# EAGLE design ESP32-C6-WROOM Breakout (EAGLE 9.6.2)
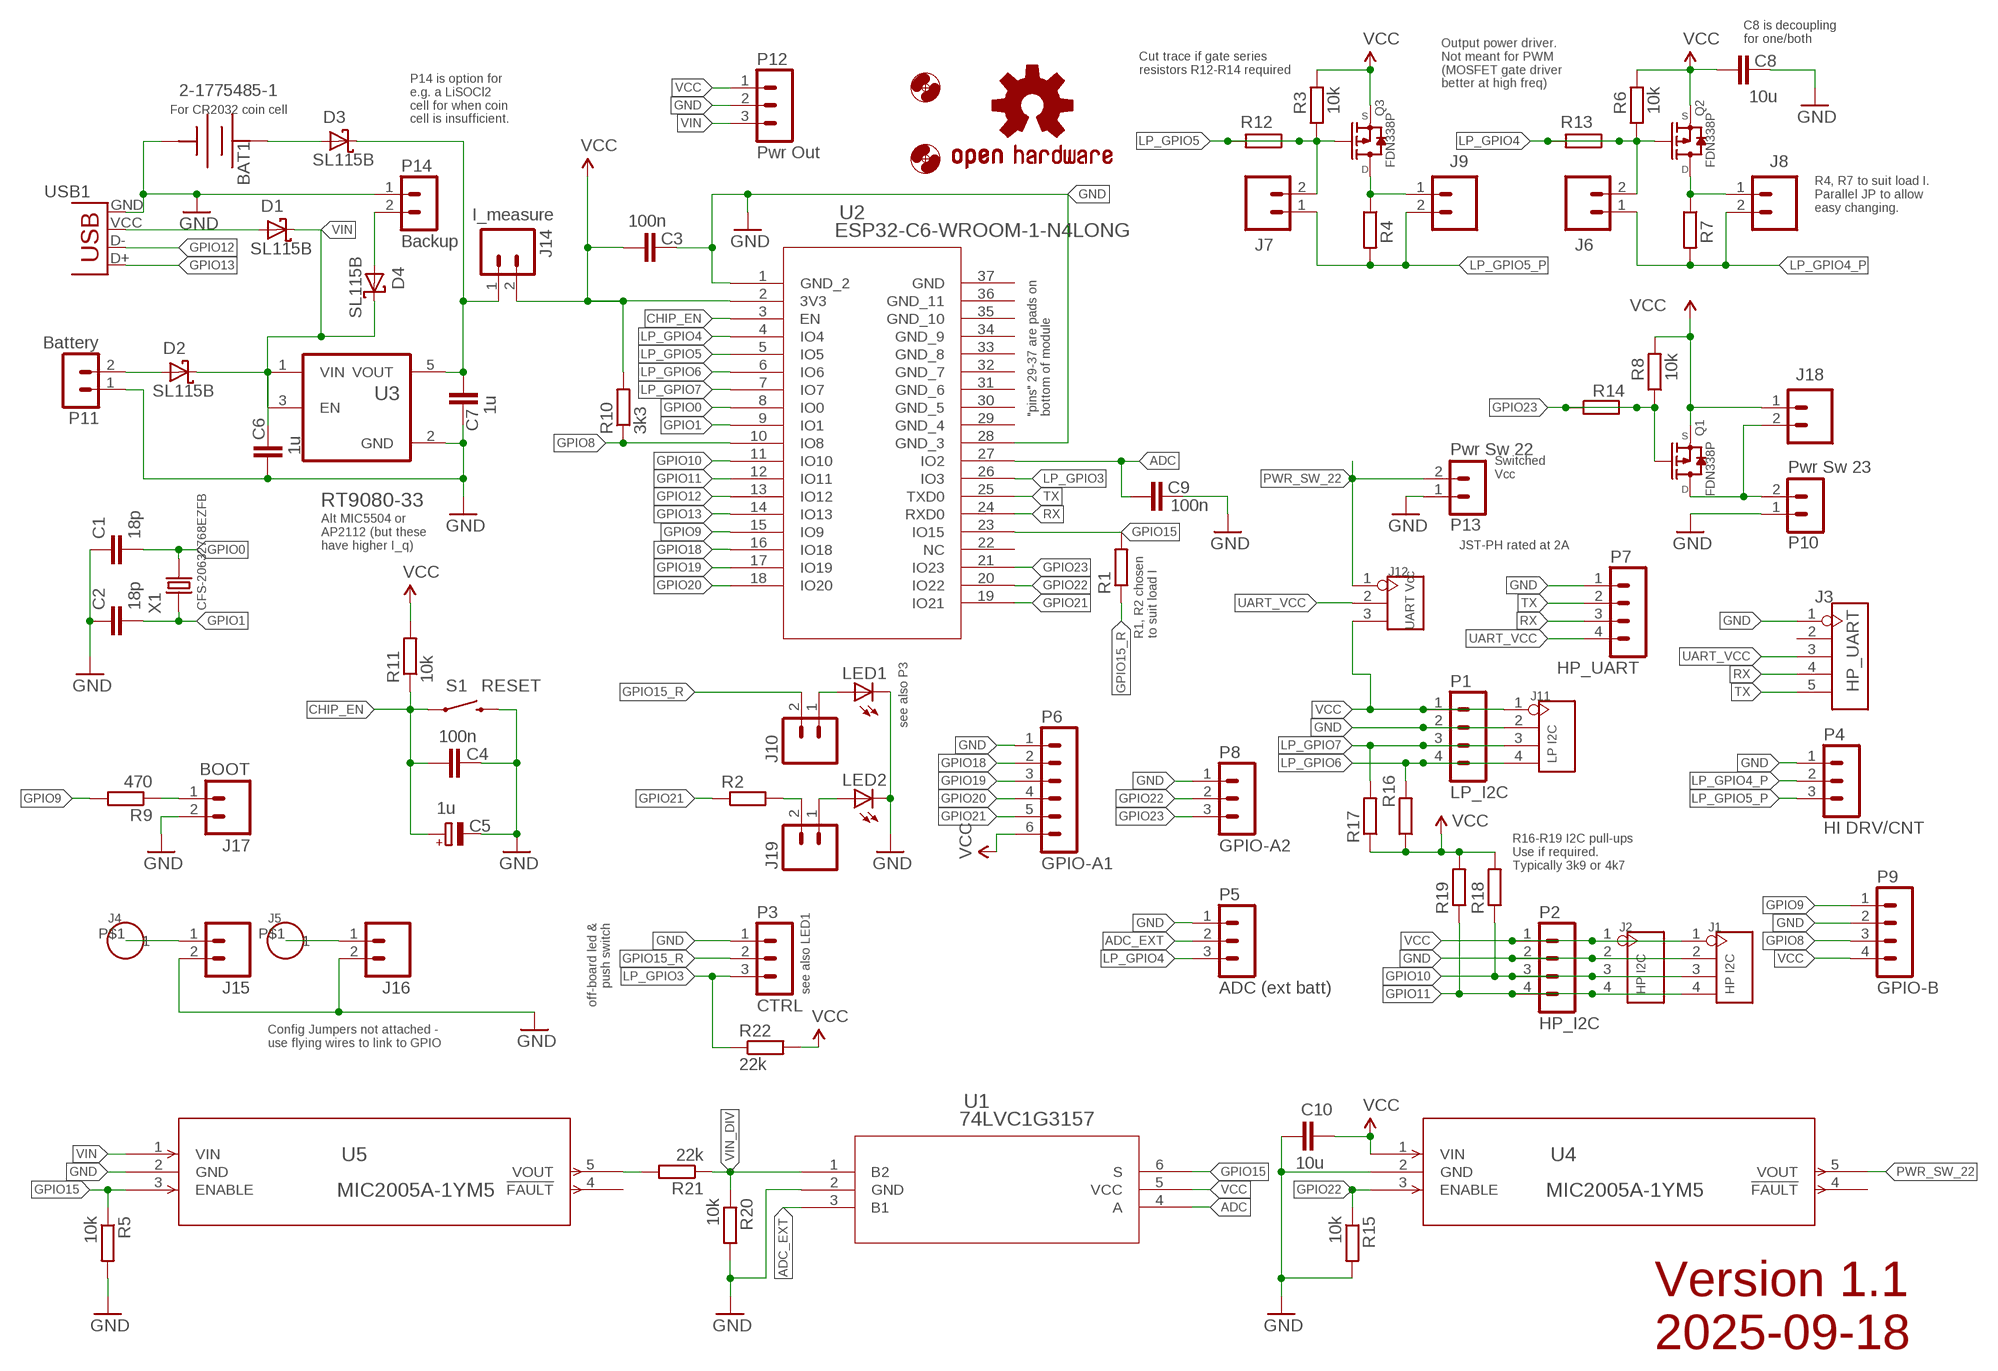
[diagram p0: schematic, sheet 1]

## Parts
BAT1  2-1775485-1  COIN-CELL  [COIN_2-1775485-1_TEC]
C1  18p  C-EU1206  [1206]
C2  18p  C-EU1206  [1206]
C3  100n  C-EU1206  [1206]
C4  100n  C-EU1206  [1206]
C5  1u  CPOL-EUE2.5-5**10UF  [E2,5-5]
C6  1u  C-EU1206  [1206]
C7  1u  C-EU1206  [1206]
C8  10u  C-EU1206  [1206]
C9  100n  C-EU1206  [1206]
C10  10u  C-EU1206  [1206]
D1  SL115B  DIODE-SCHOTTKY  [DO-214AA]
D2  SL115B  DIODE-SCHOTTKY  [DO-214AA]
D3  SL115B  DIODE-SCHOTTKY  [DO-214AA]
D4  SL115B  DIODE-SCHOTTKY  [DO-214AA]
H1  MOUNT-HOLE2.8  [2,8]
H2  MOUNT-HOLE2.8  [2,8]
J1  HP I2C  HEADER-4P-80/40MIL  [4P-2.54-80/40MIL]
J2  HP I2C  HEADER-4P-80/40MIL  [4P-2.54-80/40MIL]
J3  HP_UART  HEADER-5P-2.54  [5P-2.54]
J4  HEADER-1P-35  [1P-65/35MIL]
J5  HEADER-1P-35  [1P-65/35MIL]
J6  HEADER-1X2PPTH  [1X02]
J7  HEADER-1X2PPTH  [1X02]
J8  HEADER-1X2PPTH  [1X02]
J9  HEADER-1X2PPTH  [1X02]
J10  HEADER-1X2PPTH  [1X02]
J11  LP I2C  HEADER-4P-80/40MIL  [4P-2.54-80/40MIL]
J12  UART Vcc  HEADER-3P-2.54  [3P-2.54]
J14  I_measure  HEADER-1X2PPTH  [1X02]
J15  HEADER-1X2PPTH  [1X02]
J16  HEADER-1X2PPTH  [1X02]
J17  BOOT  HEADER-1X2PPTH  [1X02]
J18  HEADER-1X2PPTH  [1X02]
J19  HEADER-1X2PPTH  [1X02]
LED1  LED1206  [LED-1206]
LED2  LED1206  [LED-1206]
LOGO1  OSHW-LOGOL  [OSHW-LOGO-L]
P1  LP_I2C  B4B-EH-A  [B4B-EH-A]
P2  HP_I2C  B4B-EH-A  [B4B-EH-A]
P3  CTRL  B3B-EH-A  [B3B-EH-A]
P4  HI DRV/CNT  B3B-EH-A  [B3B-EH-A]
P5  ADC (ext batt)  B3B-EH-A  [B3B-EH-A]
P6  GPIO-A1  B6B-EH-A  [B6B-EH-A]
P7  HP_UART  B4B-EH-A  [B4B-EH-A]
P8  GPIO-A2  B3B-EH-A  [B3B-EH-A]
P9  GPIO-B  B4B-EH-A  [B4B-EH-A]
P10  Pwr Sw 23  B2B-PH-K  [B2B-PH-K]
P11  Battery  B2B-PH-K  [B2B-PH-K]
P12  Pwr Out  B3B-PH-K  [B3B-PH-K]
P13  Pwr Sw 22  B2B-PH-K  [B2B-PH-K]
P14  Backup  B2B-PH-K  [B2B-PH-K]
Q1  FDN338P  FDN338P_PMOSSOT23_LONG  [SOT23_LONG]
Q2  FDN338P  FDN338P_PMOSSOT23_LONG  [SOT23_LONG]
Q3  FDN338P  FDN338P_PMOSSOT23_LONG  [SOT23_LONG]
R1  R-EU_  [1206]
R2  R-EU_  [1206]
R3  10k  R-EU_  [1206]
R4  R-EU_  [1206]
R5  10k  R-EU_  [1206]
R6  10k  R-EU_  [1206]
R7  R-EU_  [1206]
R8  10k  R-EU_  [1206]
R9  470  R-EU_  [1206]
R10  3k3  R-EU_  [1206]
R11  10k  R-EU_  [1206]
R12  R-EU_  [1206]
R13  R-EU_  [1206]
R14  R-EU_  [1206]
R15  10k  R-EU_  [1206]
R16  4k7  R-EU_  [1206]
R17  4k7  R-EU_  [1206]
R18  4k7  R-EU_  [1206]
R19  4k7  R-EU_  [1206]
R20  10k  R-EU_  [1206]
R21  22k  R-EU_  [1206]
R22  22k  R-EU_  [1206]
S1  RESET  SWITCH-MOMENTARY-2PTH  [TACTILE-PTH]
U1  74LVC1G3157  SN74LVC1G3157DBVR  [DBV6]
U2  ESP32-C6-WROOM-1-N4LONG  [MOD28_ESP32-C6-WROOM-1_LONG]
U3  RT9080-33  AP2112K-3.3TRG1LONG_PADS  [SOT95-LONGPADS]
U4  MIC2005A-1YM5  MIC2005A-1YM5-TRSOT-23-5_M5_MCH-M  [SOT-23-5_M5_MCH-M]
U5  MIC2005A-1YM5  MIC2005A-1YM5-TRSOT-23-5_M5_MCH-M  [SOT-23-5_M5_MCH-M]
USB1  USB-FCI_SMD_LONG***  [FCI_USB_B_SMD_LONG]
X1  CFS-20632768EZFB  CRYSTAL-TC26H**  [TC26H]

## Nets
ADC: C9.1 U1.4(A) U2.27(IO2)
ADC_EXT: P5.2 U1.3(B1)
CHIP_EN: C4.2 C5.+ R11.1 S1.1 U2.3(EN)
GND: BAT1.2(NEG) C1.1 C2.1 C3.2 C4.1 C5.- C6.2 C7.2 C8.2 C9.2 C10.1 J1.2 J2.2 J3.1 J11.2 J15.2 J16.2 J17.2 LED1.C LED2.C P1.2 P2.2 P3.1 P4.1 P5.1 P6.1 P7.1 P8.1 P9.2 P10.1 P11.1 P12.2 P13.1 P14.1 R5.2 R15.2 R20.2 S1.3 U1.2(GND) U2.1(GND_2) U2.28(GND_3) U3.2(GND) U4.2(GND) U5.2(GND) USB1.GND
GPIO0: C1.2 U2.8(IO0) X1.2
GPIO1: C2.2 U2.9(IO1) X1.1
GPIO8: P9.3 R10.1 U2.10(IO8)
GPIO9: P9.1 R9.2 U2.15(IO9)
GPIO10: J1.3 J2.3 P2.3 R18.1 U2.11(IO10)
GPIO11: J1.4 J2.4 P2.4 R19.1 U2.12(IO11)
GPIO12: U2.13(IO12) USB1.D-
GPIO13: U2.14(IO13) USB1.D+
GPIO15: R1.2 R5.1 U1.6(S) U2.23(IO15) U5.3(ENABLE)
GPIO15_R: J10.2 P3.2 R1.1
GPIO18: P6.2 U2.16(IO18)
GPIO19: P6.3 U2.17(IO19)
GPIO20: P6.4 U2.18(IO20)
GPIO21: P6.5 R2.1 U2.19(IO21)
GPIO22: P8.2 R15.1 U2.20(IO22) U4.3(ENABLE)
GPIO23: P8.3 Q1.1(G) R8.1 R14.1 R14.2 U2.21(IO23)
LP_GPIO3: P3.3 R22.1 U2.26(IO3)
LP_GPIO4: J6.2 P5.3 Q2.1(G) R6.1 R13.1 R13.2 U2.4(IO4)
LP_GPIO4_P: J6.1 J8.2 P4.2 R7.2
LP_GPIO5: J7.2 Q3.1(G) R3.1 R12.1 R12.2 U2.5(IO5)
LP_GPIO5_P: J7.1 J9.2 P4.3 R4.2
LP_GPIO6: J11.4 P1.4 R16.2 U2.6(IO6)
LP_GPIO7: J11.3 P1.3 R17.2 U2.7(IO7)
N$1: J17.1 R9.1
N$2: D2.A P11.2
N$3: D1.A USB1.VCC(VBUS)
N$4: D4.A P14.2
N$5: J18.2 P10.2 Q1.3(D)
N$6: BAT1.1(POS) BAT1.3(POS) D3.A
N$7: J9.1 Q3.3(D) R4.1
N$8: J10.1 LED1.A
N$9: J5.P$1 J16.1
N$10: J19.2 R2.2
N$11: J19.1 LED2.A
N$12: J8.1 Q2.3(D) R7.1
N$13: C7.1 D3.C J14.1 U3.5(VOUT)
N$15: R21.2 U5.5(VOUT)
N$16: J4.P$1 J15.1
PWR_SW_22: J12.1 P13.2 U4.5(VOUT)
RX: J3.4 P7.3 U2.24(RXD0)
TX: J3.5 P7.2 U2.25(TXD0)
UART_VCC: J3.3 J12.2 P7.4
VCC: C3.1 C8.1 C10.2 J1.1 J2.1 J11.1 J12.3 J14.2 J18.1 P1.1 P2.1 P6.6 P9.4 P12.1 Q1.2(S) Q2.2(S) Q3.2(S) R3.2 R6.2 R8.2 R10.2 R11.2 R16.1 R17.1 R18.2 R19.2 R22.2 U1.5(VCC) U2.2(3V3) U4.1(VIN)
VIN: C6.1 D1.C D2.C D4.C P12.3 U3.1(VIN) U3.3(EN) U5.1(VIN)
VIN_DIV: R20.1 R21.1 U1.1(B2)
Unconnected: J3.2 U2.22(NC) U2.29(GND_4) U2.30(GND_5) U2.31(GND_6) U2.32(GND_7) U2.33(GND_8) U2.34(GND_9) U2.35(GND_10) U2.36(GND_11) U2.37(GND) U4.4(!FAULT) U5.4(!FAULT)

## Notes on the sheet
- C8 is decoupling
  for one/both
- Cut trace if gate series
  resistors R12-R14 required
- Output power driver.
  Not meant for PWM
  (MOSFET gate driver
  better at high freq)
- For CR2032 coin cell
- P14 is option for
  e.g. a LiSOCl2
  cell for when coin
  cell is insufficient.
- R4, R7 to suit load I.
  Parallel JP to allow
  easy changing.
- "pins" 29-37 are pads on
  bottom of module
- Switched
  Vcc
- Alt MIC5504 or
  AP2112 (but these
  have higher I_q)
- JST-PH rated at 2A
- R1, R2 chosen
  to suit load I
- see also P3
- R16-R19 I2C pull-ups
  Use if required.
  Typically 3k9 or 4k7
- off-board led &
  push switch
- see also LED1
- Config Jumpers not attached -
  use flying wires to link to GPIO
- Version 1.1
  2025-09-18

## Library data of the parts
BAT1 = Master 2016:COIN-CELL: Coin cell holders - various sizes of cell and footprints
C1-C4 C6-C10 = Master 2016:C-EU: CAPACITOR, European symbol
C5 = Master 2016:CPOL-EU: POLARIZED CAPACITOR, European symbol
D1-D4 = Master 2016:DIODE-SCHOTTKY: DIODE high speed (Philips)
H1 H2 = Master 2016:MOUNT-HOLE: MOUNTING HOLE with drill center marker
J1 J2 J11 = Connector:HEADER-4P
J3 = Connector:HEADER-5P
J4 J5 = Connector:HEADER-1P
J6-J10 J14-J19 = Master 2016:HEADER-1X2P: Header 2 Standard 2-pin 0.1" header. Use with straight break away headers (SKU : PRT-00116), right angle break away headers (PRT-00553), swiss pins (PRT-00743), machine pins (PRT-00117), and female headers (PRT-00115). Molex polarized connector foot print use with SKU : PRT-08233 with associated crimp pins and housings.
J12 = Connector:HEADER-3P
LED1 LED2 = Master 2016:LED: LEDs Standard schematic elements and footprints for 5mm, 3mm, 1206, and 0603 sized LEDs. 5mm - Spark Fun Electronics SKU : COM-00529 (and others)
LOGO1 = Master 2016:OSHW-LOGO: Open Source Hardware Logo This logo indicates the piece of hardware it is found on incorporates a OSHW license and/or adheres to the definition of open source hardware found here: http://freedomdefined.org/OSHW
P1 P2 P7 P9 = con-jst-eh:B4B-EH-A: HEADER
P3-P5 P8 = con-jst-eh:B3B-EH-A: HEADER
P6 = con-jst-eh:B6B-EH-A: HEADER
P10 P11 P13 P14 = con-jst-ph:B2B-PH-K: HEADER
P12 = con-jst-ph:B3B-PH-K: HEADER
Q1-Q3 = Master 2016:FDN338P_PMOS: Si2305DS Si2323CDS
R1-R22 = Master 2016:R-EU_: RESISTOR, European symbol
S1 = Master 2016:SWITCH-MOMENTARY-2: Various NO switches- pushbuttons, reed, etc
U1 = ESP32 Projects:SN74LVC1G3157DBVR; COPYRIGHT: Copyright (C) 2025 Ultra Librarian. All rights reserved.; MANUFACTURER_PART_NUMBER: SN74LVC1G3157DBVR; MFR_NAME: Texas Instruments
U2 = SMD Stamp Modules:ESP32-C6-WROOM-1-N4
U3 = AP2112K-3.3TRG1:AP2112K-3.3TRG1: AP2112 Series 0.6 A 3.3 V Fixed Output SMT LDO Linear Regulator - SOT23-5
U4 U5 = ESP32 Projects:MIC2005A-1YM5-TR; COPYRIGHT: Copyright (C) 2025 Ultra Librarian. All rights reserved.; MANUFACTURER_NAME: Microchip; MANUFACTURER_PART_NUMBER: MIC2005A-1YM5-TR
USB1 = Master 2016:USB: USB Connectors USB-B-PTH is fully proven SKU : PRT-00139 USB-miniB is fully proven SKU : PRT-00587 USB-A-PCB is untested. USB-A-H is throughly reviewed, but untested. Spark Fun Electronics SKU : PRT-00437 USB-B-SMT is throughly reviewed, but untested. Needs silkscreen touching up. USB-A-S has not been used/tested USB-MB-H has not been used/tested
X1 = Master 2016:CRYSTAL*: CRYSTAL

## Board
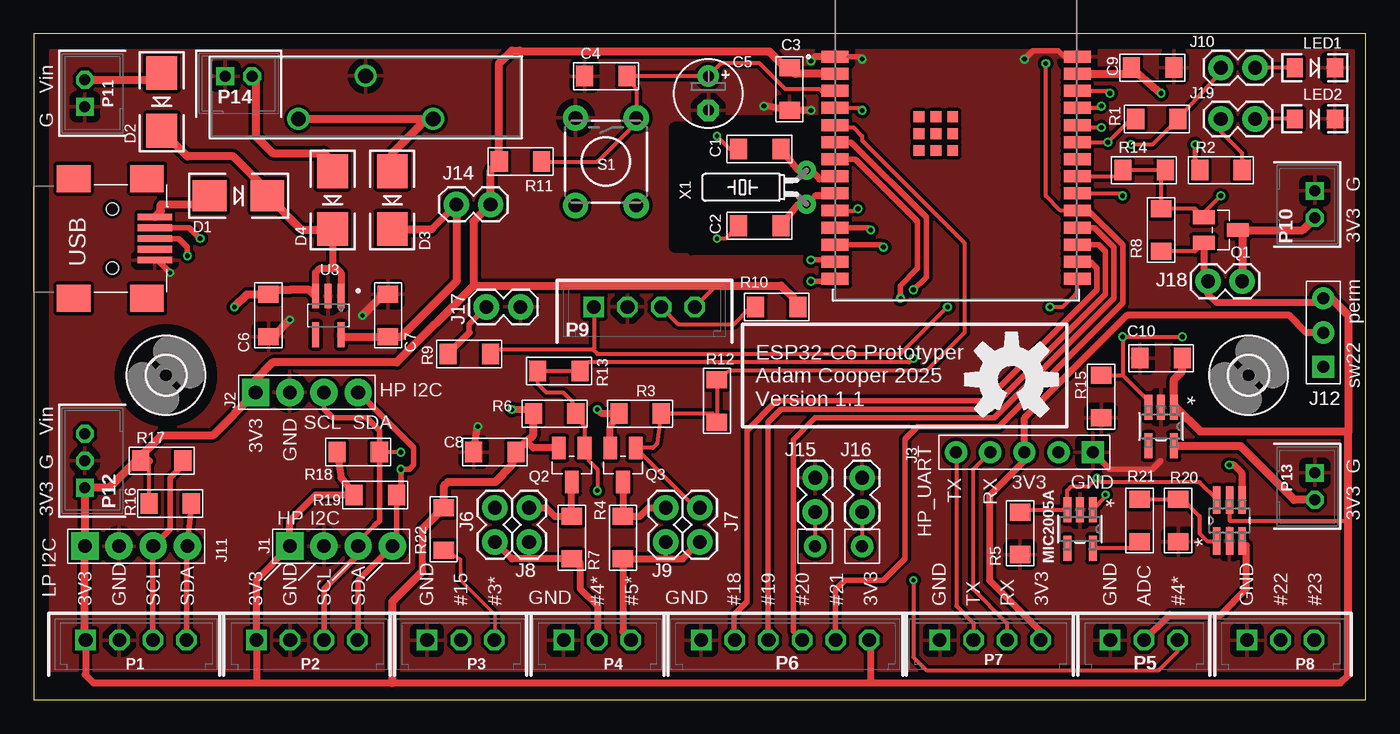
[diagram p1: board, top side]
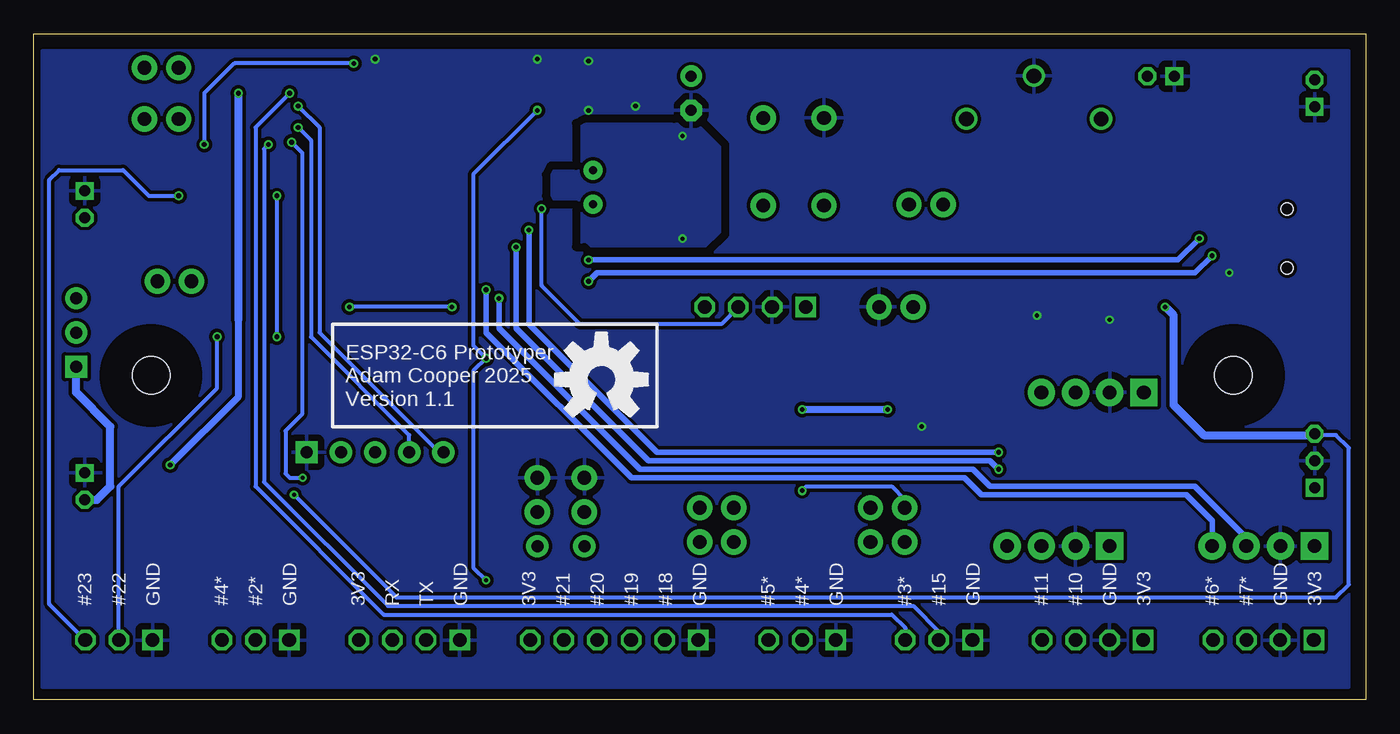
[diagram p2: board, bottom side, seen from below]

Size 99.05 x 49.52 mm. Coordinates in mm from the lower left corner, seen from the top.
Outline: 0,0 99.05,0 99.05,49.52 0,49.52 0,0
Copper layers (1*16): Top 0.035mm / dielectric 1.5mm / Bottom 0.035mm
Design rules "Seeed Fusion_eagle_rule_v1.1 *": minimum track width 6mil, minimum drill 12mil, track to track 6mil, track to pad 6mil, pad to pad 6mil, via to via 6mil, smd to smd 0mil, copper to edge 10mil, drill to drill 10mil, minimum pad ring 10mil, minimum via ring 6mil, stop-mask expansion 2mil, vias tented up to drill 100mil, thermal gap 20mil
tRestrict: area 47.6,33.7 to 58.4,42.5; 8 lines
bRestrict: 15 lines

### Footprints (pad centres in the part's own frame; a part is rotated, then mirrored left to right if it is on the bottom)
COIN_2-1775485-1_TEC = drill 1.092 pad 1.6: 1 0,0; 2 5.004,3.2; 3 10.008,0
1206 = smd 1.27 x 1.524: 1 -1.575,0; 2 1.575,0
E2,5-5 = drill 0.813 pad 1.6: + -1.27,0 | drill 0.813 pad 1.6 octagon: - 1.27,0
DO-214AA = smd 2.5 x 2.3: A -2.15,0; C 2.15,0
2,8 = hole 2.8: 0,0
4P-2.54-80/40MIL = drill 1.016 pad 2.032 square: 1 0,3.81 | drill 1.016 pad 2.032: 2 0,1.27; 3 0,-1.27; 4 0,-3.81
5P-2.54 = drill 0.889 pad 1.651 square: 1 0,5.08 | drill 0.889 pad 1.651: 2 0,2.54; 3 0,0; 4 0,-2.54; 5 0,-5.08
1P-65/35MIL = drill 0.889 pad 1.651: P$1 0,0
1X02 = drill 1.016 pad 1.88: 1 0,0; 2 2.54,0
3P-2.54 = drill 0.889 pad 1.651 square: 1 0,2.54 | drill 0.889 pad 1.651: 2 0,0; 3 0,-2.54
LED-1206 = smd 1.2 x 1.4: A -1.5,0; C 1.5,0
B4B-EH-A = drill 1.016 square: 1 -3.75,0 | drill 1.016 octagon: 2 -1.25,0; 3 1.25,0; 4 3.75,0
B3B-EH-A = drill 1.016 square: 1 -2.5,0 | drill 1.016 octagon: 2 0,0; 3 2.5,0
B6B-EH-A = drill 1.016 square: 1 -6.25,0 | drill 1.016 octagon: 2 -3.75,0; 3 -1.25,0; 4 1.25,0; 5 3.75,0; 6 6.25,0
B2B-PH-K = drill 0.813 square: 1 -1,0 | drill 0.813 octagon: 2 1,0
B3B-PH-K = drill 0.813 square: 1 -2,0 | drill 0.813 octagon: 2 0,0; 3 2,0
SOT23_LONG = smd 1.016 x 1.651: 1 -0.95,-1.27; 2 0.95,-1.27; 3 0,1.27
TACTILE-PTH = drill 1.016 pad 1.88: 1 -3.251,2.261; 2 3.251,2.261; 3 -3.251,-2.261; 4 3.251,-2.261
DBV6 = smd 2.032 x 0.559: 1 -1.524,0.95; 2 -1.524,0; 3 -1.524,-0.95; 4 1.524,-0.95; 5 1.524,0; 6 1.524,0.95
MOD28_ESP32-C6-WROOM-1_LONG = smd 2.007 x 0.889: 1 -9.004,5.26; 2 -9.004,3.99; 3 -9.004,2.72; 4 -9.004,1.45; 5 -9.004,0.18; 6 -9.004,-1.09; 7 -9.004,-2.36; 8 -9.004,-3.63; 9 -9.004,-4.9; 10 -9.004,-6.17; 11 -9.004,-7.44; 12 -9.004,-8.71; 13 -9.004,-9.98; 14 -9.004,-11.25; 15 9.004,-11.25; 16 9.004,-9.98; 17 9.004,-8.71; 18 9.004,-7.44; 19 9.004,-6.17; 20 9.004,-4.9; 21 9.004,-3.63; 22 9.004,-2.36; 23 9.004,-1.09; 24 9.004,0.18; 25 9.004,1.45; 26 9.004,2.72; 27 9.004,3.99; 28 9.004,5.26 | smd 0.813 x 0.813: 29 -1.505,-0.46; 30 -2.755,0.79; 31 -2.755,-0.46; 32 -2.755,-1.71; 33 -1.505,-1.71; 34 -0.255,-1.71; 35 -0.255,-0.46; 36 -0.255,0.79; 37 -1.505,0.79
SOT95-LONGPADS = smd 1.858 x 0.6: 1 -1.439,0.95; 2 -1.439,0; 3 -1.439,-0.95; 4 1.439,-0.95; 5 1.439,0.95
SOT-23-5_M5_MCH-M = smd 1.857 x 0.597: 1 -1.439,0.95; 2 -1.439,0; 3 -1.439,-0.95; 4 1.439,-0.95; 5 1.439,0.95
FCI_USB_B_SMD_LONG = smd 0.5 x 2.54: D+ 0,9.017; D- -0.8,9.017; GND 1.6,9.017; ID 0.8,9.017; VCC -1.6,9.017 | smd 2 x 2.5: SH$1 -4.45,8.43; SH$2 4.45,8.43; SH$3 4.45,2.98; SH$4 -4.45,2.98 | hole 0.9: -2.2,5.85; 2.2,5.85
TC26H = drill 0.6 pad 1.422: 1 -1.27,0; 2 1.27,0

### Placement (x,y rotation side)
BAT1  19.68,43.18 0 top
C1  53.98,40.96 0 top
C2  53.98,35.24 0 top
C3  56.2,45.4 270 top
C4  42.55,46.35 0 top
C5  50.16,45.09 270 top
C6  17.46,28.57 270 top
C7  26.35,28.57 90 top
C8  34.29,18.41 180 top
C9  83.19,46.99 0 top
C10  83.82,25.4 0 top
D1  15.24,37.47 0 top
D2  9.53,44.45 270 top
D3  26.67,37.15 270 top
D4  22.23,37.15 270 top
H1  9.84,24.13 0 top
H2  90.32,24.13 0 top
J1  22.86,11.43 90 top
J2  20.32,22.86 90 top
J3  73.66,18.41 270 top
J4  58.1,11.43 0 top
J5  61.59,11.43 0 top
J6  34.29,11.75 90 top
J7  49.53,11.75 90 top
J8  36.83,14.29 270 top
J9  46.99,14.29 270 top
J10  90.81,46.99 180 top
J11  7.62,11.43 90 top
J12  95.89,27.3 180 top
J14  31.43,36.83 0 top
J15  58.1,13.97 90 top
J16  61.59,13.97 90 top
J17  33.66,29.21 0 top
J18  87.31,31.11 0 top
J19  90.81,43.18 180 top
LED1  95.25,46.99 0 top
LED2  95.25,43.18 0 top
LOGO1  72.71,23.81 0 top
LOGO2  OSHW-LOGOL  [OSHW-LOGO-L]  56.83,23.81 0 bottom
P1  7.62,4.45 0 top
P2  20.32,4.45 0 top
P3  31.75,4.45 0 top
P4  41.91,4.45 0 top
P5  82.55,4.45 0 top
P6  55.88,4.45 0 top
P7  71.12,4.45 0 top
P8  92.71,4.45 0 top
P9  45.4,29.21 0 top
P10  95.25,36.83 270 top
P11  3.81,45.09 90 top
P12  3.81,17.78 90 top
P13  95.25,15.88 270 top
P14  15.24,46.35 0 top
Q1  88.27,34.92 270 top
Q2  40.01,17.46 180 top
Q3  43.81,17.46 180 top
R1  83.5,43.18 180 top
R2  88.27,39.37 0 top
R3  45.09,21.27 180 top
R4  43.81,12.06 270 top
R5  73.34,12.38 270 top
R6  38.73,21.27 180 top
R7  40.01,12.06 270 top
R8  83.82,34.92 270 top
R9  32.38,25.72 0 top
R10  55.24,29.21 0 top
R11  36.2,40.01 180 top
R12  50.8,22.23 90 top
R13  39.05,24.45 0 top
R14  82.55,39.37 0 top
R15  79.38,22.54 270 top
R16  10.16,14.61 0 top
R17  9.53,17.78 0 top
R18  24.13,18.41 180 top
R19  25.4,15.24 180 top
R20  85.09,13.34 270 top
R21  82.23,13.34 270 top
R22  30.48,12.7 90 top
S1  42.55,40.01 270 top
U1  88.9,13.34 90 top
U2  68.58,42.55 0 top
U3  21.91,28.57 270 top
U4  83.82,20.32 270 top
U5  77.79,12.7 270 top
USB1  0,34.29 270 top
X1  57.47,38.1 90 top

### Tracks (layer width: path | path; a pad name or v marks a point on that pad's centre or on a via)
ADC  (via drill 0.35)
  Top 0.152: 81.46,46.53 C9.1
  Top 0.508: U1.4 89.85,16.83 89.22,17.46 v88.9,17.46
  Top 0.61: U2.27 81.46,46.53 | C9.1 v83.82,45.09
  Bottom 0.508: v88.9,17.46 83.82,22.54 83.82,28.26
  Bottom 0.61: 83.82,28.26 v83.82,45.09
ADC_EXT
  Top 0.305: 90.17,11.49 U1.3
  Top 0.508: P5.2 84.45,6.35 88.27,6.35 90.17,8.26 90.17,11.49
CHIP_EN
  Top 0.305: U2.3 58.56,45.27 58.42,45.4 55.88,45.4 53.98,47.31 51.12,47.31 C5.+ C4.2 44.81,45.36 S1.1 44.81,42.9 41.91,40.01 R11.1
GND  (via drill 0.3 pad 0.61, 0.35)
  Top 0.305: U2.28 76.66,47.8 | 58.1,47.8 v57.78,47.49 | C1.1 51.75,40.96 v50.8,41.91 | C2.1 51.45,34.29 v50.8,34.29
  Top 0.406: U2.1 61.41,47.8 v61.59,47.62 | 76.66,47.8 76.2,48.26 74.3,48.26 v73.66,47.62 | 83.82,17.78 83.19,17.14 80.01,17.14 J3.1 | USB1.GND 9.22,32.69 v10.16,31.75
  Top 0.508: v54.29,44.13 54.39,44.17 C3.2 57.19,43.83 57.2,43.76 57.25,43.81 v57.78,43.81 | U2.1 58.1,47.8 | C8.2 v33.02,20.32
  Top 0.61: 82.55,25.4 C10.1 | C6.2 17.79,27 v19.05,28.26 | C7.2 26.02,30.15 v24.45,28.57
  pour Bottom (isolate 0.254): 1.27,48.26 1.27,0.95 98.42,0.95 98.42,48.26
  pour Top (isolate 0.254): 1.27,48.26 1.27,2.22 98.11,2.22 98.11,48.26
GPIO0
  Top 0.305: 56.83,39.37 X1.2 57.78,39.05 58.1,39.05 | 58.42,38.73 59.65,38.73 U2.8
  Top 0.508: 56.83,39.37 C1.2 | 58.1,39.05 58.42,38.73
GPIO1
  Top 0.305: U2.9 59.65,37.47 | 58.1,37.47 X1.1 56.83,36.83
  Top 0.508: 59.65,37.47 58.1,37.47 | 56.83,36.83 C2.2
GPIO8  (via drill 0.35)
  Top 0.305: U2.10 61.14,36.38 v61.28,36.51 | P9.3 47.92,27.94 52.07,27.94 53.34,29.21 R10.1
  Bottom 0.305: v61.28,36.51 61.28,30.8 58.42,27.94 47.92,27.94 P9.3
GPIO9  (via drill 0.35)
  Top 0.305: v75.56,29.21 76.52,29.21 77.44,30.13 77.58,30.5 U2.15 | v67.94,29.21 64.45,25.72 41.91,25.72 41.59,26.04 | 41.59,26.04 34.28,26.04 R9.2 | P9.1 41.65,26.09 41.59,26.04
  Bottom 0.305: v67.94,29.21 v75.56,29.21
GPIO10  (via drill 0.35)
  Top 0.305: P2.3 21.59,4.46 | 24.13,10.79 J1.3 24.13,11.75 25.35,12.97 25.35,12.98 | 62.05,35.1 v62.23,34.92 | v27.3,18.41 R18.1 | J2.3 21.59,21.59 | 25.72,20 25.7,20
  Top 0.406: 21.59,4.46 21.59,8.26 24.13,10.79 | U2.11 62.05,35.1 | 25.35,12.98 25.7,13.34 R18.1 25.7,20 | 21.59,21.59 22.23,20.95 24.77,20.95 25.72,20
  Bottom 0.406: v62.23,34.92 62.23,27.94 52.7,18.41 v27.3,18.41
GPIO11  (via drill 0.35)
  Top 0.305: P2.4 24.13,4.5 | 63,33.84 v63.18,33.66 | 27.3,15.88 R19.1 | 26.98,11.73 J1.4
  Top 0.406: 24.13,4.5 24.13,8.89 J1.4 | U2.12 63,33.84 | 27.3,15.88 v27.3,17.14 27.94,17.14 28.26,17.46 28.26,18.73 J2.4 | R19.1 26.98,11.73
  Bottom 0.406: v63.18,33.66 63.18,27.62 53.34,17.78 27.94,17.78 v27.3,17.14
GPIO12  (via drill 0.35)
  Top 0.305: U2.13 59.69,32.7
  Top 0.406: 59.69,32.7 v57.78,32.7 | USB1.D- 11.58,35.09 v12.38,34.29
  Bottom 0.406: v12.38,34.29 13.97,32.7 v57.78,32.7
GPIO13  (via drill 0.35)
  Top 0.305: 59.65,31.11 U2.14
  Top 0.406: v57.78,31.11 59.65,31.11 | USB1.D+ 10.79,34.29 11.43,33.66 v11.43,33.02
  Bottom 0.406: v57.78,31.11 57.15,31.75 12.7,31.75 v11.43,33.02
GPIO15  (via drill 0.3 pad 0.61, 0.35)
  Top 0.305: U2.23 v79.87,41.45 81.75,43.33 R1.2 | U1.6 87.95,14.92 86.68,16.19 79.38,16.19 v79.06,16.51 78.42,15.88 77.15,15.88 76.84,15.56 U5.3 73.52,14.14 R5.1
  Bottom 0.305: v79.87,41.45 79.06,40.64 79.06,21.27 80.33,20 80.33,16.83 80.01,16.51 v79.06,16.51
GPIO15_R  (via drill 0.35)
  Top 0.305: J10.2 88.27,46.65 R1.1 83.19,41.27 v81.6,41.27
  Bottom 0.305: v81.6,41.27 81.92,40.96 81.92,16.19 72.71,6.99 33.66,6.99 31.75,5.08 P3.2
GPIO18
  Top 0.305: U2.16 78.56,32.56
  Top 0.381: 52.07,4.5 P6.2
  Top 0.406: 78.56,32.56 79.06,32.07 79.06,30.48 70.8,22.23 55.24,22.23 53.02,20 53.02,7.3 52.07,6.35 52.07,4.5
GPIO19
  Top 0.305: P6.3 54.61,4.46
  Top 0.406: U2.17 79.19,33.84 79.69,33.34 79.69,30.16 71.12,21.59 55.56,21.59 54.61,20.64 54.61,4.46
GPIO20
  Top 0.305: P6.4 56.48,5.1
  Top 0.406: U2.18 78.88,35.1 80.33,33.66 80.33,29.84 71.44,20.95 58.1,20.95 56.48,19.33 56.48,5.1
GPIO21  (via drill 0.35)
  Top 0.305: 78.42,36.38 U2.19 76.34,36.38 75.25,37.47 v75.25,47.31 | 59.61,4.46 P6.5
  Top 0.381: R2.1 86.36,39.54 v86.36,41.27
  Top 0.406: 78.42,36.38 80.96,33.84 80.96,29.53 71.75,20.32 65.72,20.32 64.77,19.37 64.77,10.48 63.18,8.89 60.33,8.89 59.61,8.18 59.61,4.46
  Bottom 0.305: v86.36,41.27 86.36,45.09 84.14,47.31 v75.25,47.31
GPIO22  (via drill 0.35)
  Top 0.305: U2.20 80.78,37.65 v80.96,37.47 | v85.41,26.99 v80.96,26.99 80.96,24.13 | U4.3 82.87,22.22 80.96,24.13 | R15.1 80.96,24.13
  Bottom 0.305: v80.96,37.47 v80.96,26.99 | P8.2 92.71,15.88 85.41,23.18 v85.41,26.99
GPIO23  (via drill 0.35)
  Top 0.305: U2.21 80.83,38.91 R14.1 R14.2 83.82,39.06 R8.1 83.84,36.5 83.84,36.51 86.36,36.51 Q1.1 87,36.2 v88.27,37.47
  Bottom 0.305: P8.3 97.88,7.11 97.88,38.65 97.16,39.37 92.39,39.37 90.49,37.47 v88.27,37.47
LP_GPIO3  (via drill 0.35)
  Top 0.254: R22.1 31.75,10.46 31.75,8.89 34.29,6.35 34.29,4.49 P3.3
  Top 0.305: U2.26 79.83,45.27 v80.01,45.09
  Bottom 0.305: v80.01,45.09 82.55,42.55 82.55,15.88 73.03,6.35 35.24,6.35 34.25,5.36 P3.3
LP_GPIO4  (via drill 0.3 pad 0.61, 0.35)
  Top 0.254: 37.48,23.48 R13.1
  Top 0.305: R13.1 R13.2 41.26,25.08 65.09,25.08 v65.41,25.4 | U2.4 61.41,43.99 v61.59,43.81 | v41.91,15.56 41.91,17.14 41.27,17.78 41.27,18.41 Q2.1 40.95,20.32 R6.1 40.01,22.23 39.37,22.86 38.1,22.86 37.48,23.48 | v65.41,8.89 65.41,3.17 66.36,2.22 83.64,2.22 85.05,3.63 P5.3
  Bottom 0.305: v61.59,43.81 66.36,39.05 66.36,26.35 v65.41,25.4 66.36,24.45 66.36,9.84 v65.41,8.89 | J6.2 34.29,14.92 35.24,15.88 41.59,15.88 v41.91,15.56
LP_GPIO4_P
  Top 0.305: R7.2 40.64,10.16 | J8.2 36.83,10.79 36.83,10.49 36.83,10.48
  Top 0.508: 40.64,10.16 40.64,8.26 41.91,6.99 P4.2 | R7.2 36.83,10.49 | 36.83,10.48 35.56,10.48 J6.1
LP_GPIO5
  Top 0.305: J7.2 49.21,14.29 Q3.1 46.04,18.73 46.35,19.05 R3.1 50.48,21.27 R12.1 R12.2 51.75,24.45 66.36,24.45 69.22,27.3 69.22,33.97 61.59,41.59 61.59,41.91 60.96,42.55 60.01,42.55 U2.5
LP_GPIO5_P
  Top 0.305: J9.2 46.99,10.79 46.99,10.49 46.99,10.48
  Top 0.508: P4.3 43.81,5.04 R4.2 46.99,10.49 | 46.99,10.48 48.26,10.48 J7.1
LP_GPIO6  (via drill 0.35)
  Top 0.305: 11.37,11.37 J11.4
  Top 0.406: P1.4 11.37,11.37 | J11.4 R16.2 | U2.6 60.78,41.45 66.36,35.88 66.36,31.43 v65.41,30.48
  Bottom 0.406: v65.41,30.48 65.41,27.3 54.61,16.51 29.84,16.51 28.57,15.24 13.34,15.24 11.43,13.34 J11.4
LP_GPIO7  (via drill 0.35)
  Top 0.305: 8.87,11.41 J11.3 | R17.2 10.79,17.14
  Top 0.406: P1.3 8.87,11.41 | 10.79,17.14 10.16,16.51 10.16,12.7 J11.3 | U2.7 61.1,40.19 65.72,35.56 65.72,32.07 64.45,30.8 v64.45,29.84
  Bottom 0.406: v64.45,29.84 64.45,27.62 53.98,17.14 29.21,17.14 27.94,15.88 12.7,15.88 8.89,12.06 J11.3
N$1
  Top 0.406: J17.1 32.38,27.94 32.38,27.29
  Top 0.508: 32.38,27.29 R9.1
N$2
  Top 0.61: P11.2 9.01,46.09 D2.A
N$3
  Top 0.305: 12.7,36.83 13.09,37.22 D1.A
  Top 0.61: USB1.VCC 9.46,36.34 9.46,36.83 12.7,36.83
N$4
  Top 0.61: P14.2 16.51,46.09 16.51,41.91 17.78,40.64 21.59,40.64 22.23,40.01 D4.A
N$5
  Top 0.61: P10.2 94.34,34.92 Q1.3 89.85,34.61 J18.2
N$6
  Top 0.61: BAT1.1 29.21,43.18 | 29.21,43.18 BAT1.3 | D3.A 26.67,40.64 29.21,43.18
N$7
  Top 0.508: Q3.3 R4.1 45.08,13.64 45.09,13.65 45.72,14.29 J9.1
N$8
  Top 0.305: LED1.A J10.1
N$9
  Top 0.305: J16.1 J5.P$1
N$10
  Top 0.305: J19.2 88.27,42.23 89.84,40.65 R2.2
N$11
  Top 0.305: LED2.A J19.1
N$12
  Top 0.508: Q2.3 R7.1 38.74,13.64 38.73,13.65 38.1,14.29 J8.1
N$13
  Top 0.508: 29.6,35 J14.1
  Top 0.61: D3.C 29.6,35 | J14.1 31.43,31.11 27.32,27 C7.1 22.99,27 U3.5
N$15
  Top 0.305: R21.2 81.73,11.26 U5.5
N$16
  Top 0.305: J15.1 J4.P$1
PWR_SW_22
  Top 0.61: U4.5 89.7,18.88 93.71,14.88 P13.2
  Bottom 0.61: P13.2 94.34,14.88 93.34,15.88 93.34,20.32 95.89,22.86 J12.1
RX  (via drill 0.35)
  Top 0.305: U2.24 77.51,42.55 v79.38,42.55 | J3.4 69.83,17.12 69.83,8.26 72.37,5.71 P7.3
  Bottom 0.305: v79.38,42.55 78.42,41.59 78.42,26.99 71.12,19.68 J3.4
TX  (via drill 0.35)
  Top 0.305: J3.5 68.6,18.39 68.6,6.99 69.87,5.71 P7.2 | U2.25 79.24,43.99 v79.38,44.13
  Bottom 0.305: v79.38,44.13 77.79,42.55 77.79,27.3 68.9,18.41 J3.5
UART_VCC
  Top 0.508: P7.4 74.87,5.08 71.06,8.89 71.06,15.18 73.66,17.78 J3.3 73.66,20.95 81.28,28.57 93.34,28.57 94.61,27.3 J12.2
VCC  (via drill 0.35)
  Top 0.305: R17.1 7.96,17.74 | R16.1 8.59,17.74 | 16.57,1.33 16.51,1.27 | 37.15,21.59 R6.2 | R8.2 86.36,33.34 Q1.2 | U1.5 88.9,13.34 97.73,13.34 | P9.4 50.74,30.8 55.56,30.8
  Top 0.508: Q3.2 42.87,20.32 R3.2 42.23,21.27 v41.91,21.59 | R18.2 22.86,16.51 R19.2 20.95,15.24 19.05,13.34 J1.1 16.57,8.95 P2.1 16.57,1.33 | P1.1 3.87,1.97 3.81,1.91 4.45,1.27 16.51,1.27 26.67,1.27 62.23,1.27 | 62.23,1.27 97.16,1.27 97.73,1.84 | v35.56,21.59 37.15,21.59 | P6.6 62.23,4.34 62.23,1.27 | Q1.2 87,31.43 J18.1 87.31,30.16 87.95,29.53 95.25,29.53 95.57,29.84 | Q2.2 37.15,18.73 36.66,19.21 | 28.89,12.69 28.89,9.53
  Top 0.61: R17.1 8.26,18.41 9.53,19.68 13.34,19.68 J2.1 16.51,23.81 17.78,25.08 26.99,25.08 32.7,30.8 | 32.7,30.8 32.7,35.56 J14.2 33.97,39.36 R11.2 34.62,47.32 35.56,48.26 36.13,48.26 36.2,48.2 54.67,48.2 55.99,46.88 C3.1 56.64,46.54 56.66,46.53 U2.2 | 32.7,30.8 55.56,30.8 56.52,29.84 R10.2 | 97.73,1.84 97.73,13.34 97.73,19.94 | 8.59,17.74 7.96,17.74 7.58,17.74 5.62,15.78 P12.1 J11.1 3.81,4.5 P1.1 | 95.57,29.84 J12.3 96.46,29.84 97.73,28.57 97.73,19.94 | C10.2 85.39,24.43 84.77,23.81 U4.1 84.92,21.76 86.73,19.95 97.74,19.95 97.73,19.94 | R6.2 37.16,19.71 36.66,19.21 C8.1 35.56,17.46 34.29,16.19 30.8,16.19 30.48,15.88 R22.2 28.89,12.69 | 26.67,1.27 26.67,7.3 28.89,9.53
  Bottom 0.508: v41.91,21.59 v35.56,21.59
VIN  (via drill 0.3 pad 0.61, 0.35)
  Top 0.305: v79.69,15.24 79.69,15.09 U5.1
  Top 0.508: 22.26,34.96 D4.C 22.23,32.07 | U3.3 20.96,31.75 21.27,32.07 22.23,32.07 | 22.23,32.07 22.54,32.07 22.86,31.75 U3.1
  Top 0.61: D2.C 11.43,40.4 14.85,40.4 17.39,37.85 D1.C 19.89,34.96 22.26,34.96 | U3.3 20.49,30.48 19.05,30.48 19.04,30.47 17.78,30.47 C6.1 15.86,30.15 v14.92,29.21 | U3.1
  Bottom 0.305: v79.69,15.24 72.07,7.62 2.22,7.62 1.27,8.57 1.27,18.73 2.22,19.68 3.9,19.68
  Bottom 0.61: v14.92,29.21 14.29,28.57 14.29,21.91 12.06,19.68 3.9,19.68 P12.3
VIN_DIV
  Top 0.305: R21.1 R20.1 85.42,14.91 86.68,13.65 86.68,12.38 87.25,11.81 U1.1

### Text on the board
tPlace: Vin | G | G | 3V3 | perm | ESP32-C6 Prototyper / Adam Cooper 2025 / Version 1.1 | sw22 | 3V3 | GND | SCL | SDA | Vin | G | TX | RX | G | 3V3 | GND | 3V3 | 3V3 | MIC2005A | GND | GND | 3V3 | GND | SCL | SDA | 3V3 | GND | SCL | SDA | GND | #15 | #3* | #4* | #5* | #18 | #19 | #20 | #21 | 3V3 | GND | TX | RX | 3V3 | GND | ADC | #4* | GND | #22 | #23
bPlace: ESP32-C6 Prototyper / Adam Cooper 2025 / Version 1.1 | 3V3 | GND | #7* | #6* | 3V3 | GND | #10 | #11 | GND | #15 | #3* | GND | #4* | #5* | GND | #18 | #19 | #20 | #21 | 3V3 | GND | TX | RX | 3V3 | GND | #2* | #4* | GND | #22 | #23
_tNames: J10 | C4 | C3 | LED1 | C5 | P11 | C9 | P14 | J19 | LED2 | R1 | D2 | R14 | R2 | C1 | J14 | S1 | X1 | R11 | D1 | D4 | D3 | C2 | R8 | Q1 | P10 | U3 | R10 | J18 | J17 | C6 | C7 | P9 | C10 | R9 | R12 | R13 | R15 | J2 | R3 | J12 | R6 | R17 | C8 | J15 | J16 | J3 | R18 | Q3 | R20 | Q2 | R21 | R19 | P13 | P12 | R16 | J6 | J7 | R4 | J11 | J1 | R22 | R7 | R5 | J8 | J9 | P7 | P1 | P2 | P3 | P4 | P6 | P5 | P8
_tValues: BAT1 | U2 | U4 | U5 | U1